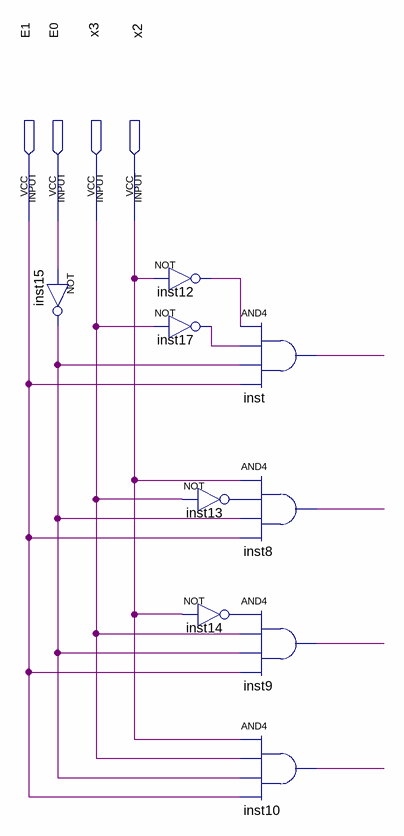
[diagram p0: schematic sheet]
// Quartus schematic Dec2_4(2).bdf as structural Verilog: 9 symbols, 4 pins
module \Dec2_4(2)  (
  input  E1,
  input  E0,
  input  x3,
  input  x2
);

  wire inst8_out, inst9_out, inst10_out, inst12_out, inst13_out, inst14_out, inst15_out, inst17_out, inst_out;

  not inst15 (inst15_out, E0);
  not inst12 (inst12_out, x2);
  not inst17 (inst17_out, x3);
  not inst13 (inst13_out, x3);
  not inst14 (inst14_out, x2);
  and inst (inst_out, inst12_out, inst17_out, inst15_out, E1);
  and inst8 (inst8_out, x2, inst13_out, inst15_out, E1);
  and inst9 (inst9_out, inst14_out, x3, inst15_out, E1);
  and inst10 (inst10_out, x2, x3, inst15_out, E1);
endmodule
